# Altium schematic sheet MCU.SchDoc: N64 Controller
size A4; Author: TheComet; Revision: 1.0.0; ProjectName: N64 Controller
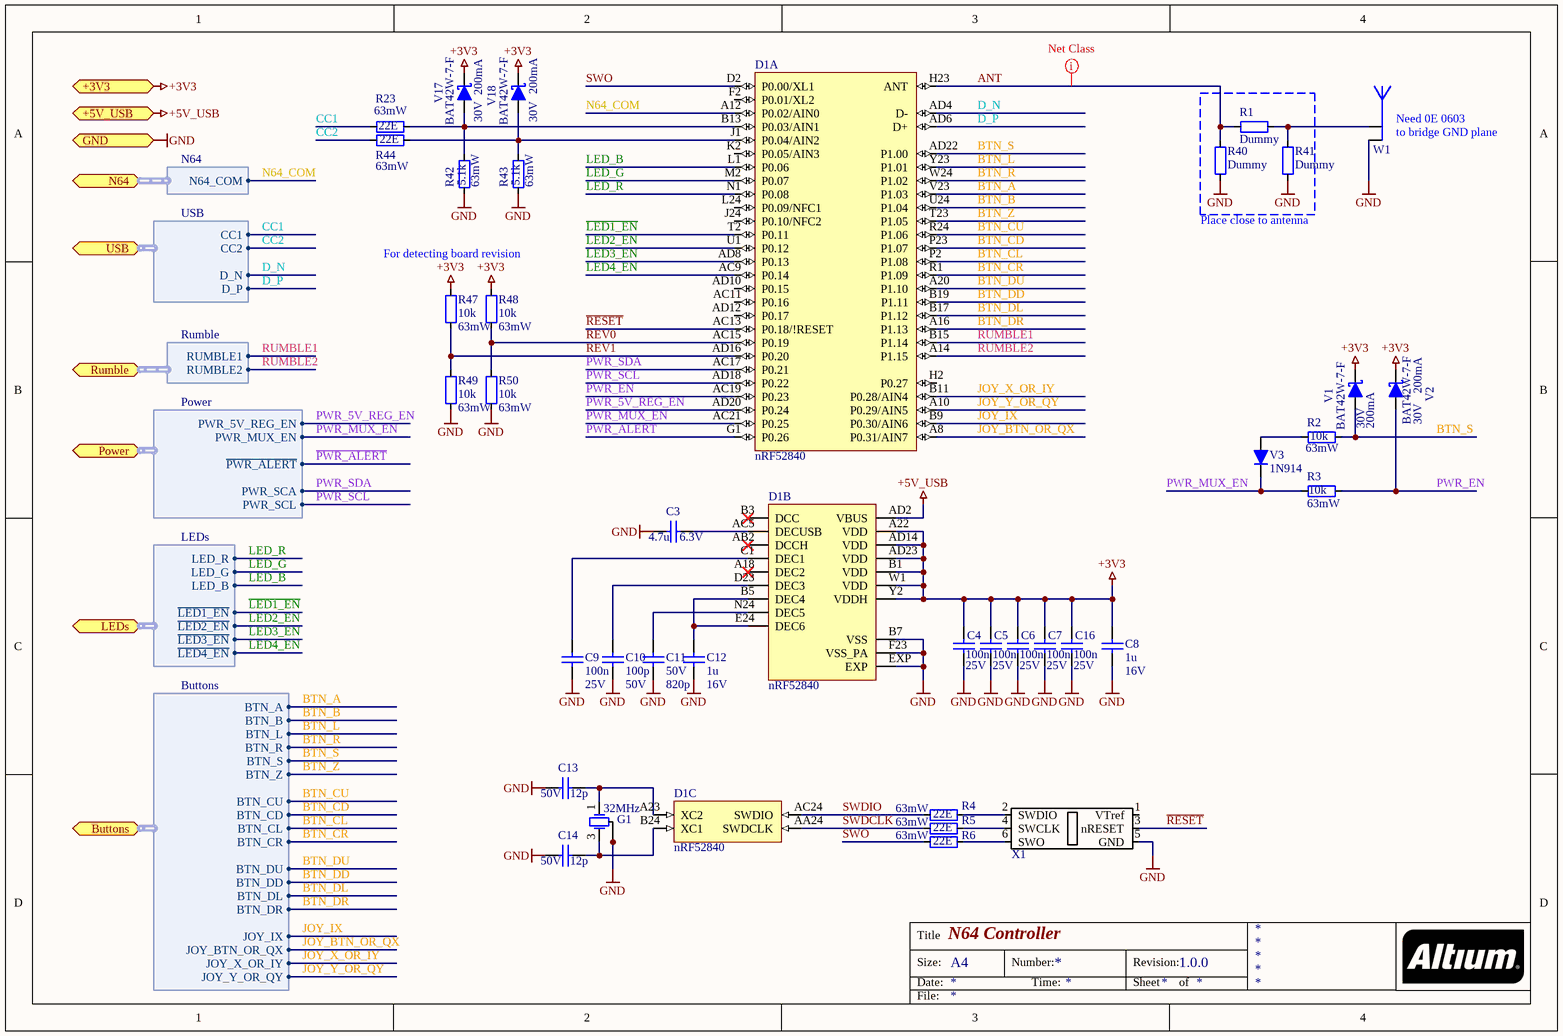
[diagram p0: MCU.SchDoc]

## Parts
C3  value 4.7u  Value2: 6.3V  [SMD_CAP_0603]  (hidden comment: C_SMD_CER_4U7_6V3_10%_X5R_0603)
C4  value 100n  Value2: 25V  [SMD_CAP_0402]  (hidden comment: C_SMD_CER_100N_25V_10%_X7R_0402)
C5  value 100n  Value2: 25V  [SMD_CAP_0402]  (hidden comment: C_SMD_CER_100N_25V_10%_X7R_0402)
C6  value 100n  Value2: 25V  [SMD_CAP_0402]  (hidden comment: C_SMD_CER_100N_25V_10%_X7R_0402)
C7  value 100n  Value2: 25V  [SMD_CAP_0402]  (hidden comment: C_SMD_CER_100N_25V_10%_X7R_0402)
C8  value 1u  Value2: 16V  [SMD_CAP_0603]  (hidden comment: C_SMD_CER_1U_16V_10%_X7R_0603)
C9  value 100n  Value2: 25V  [SMD_CAP_0402]  (hidden comment: C_SMD_CER_100N_25V_10%_X7R_0402)
C10  value 100p  Value2: 50V  [SMD_CAP_0402]  (hidden comment: C_SMD_CER_100P_50V_5%_NP0_0402)
C11  value 820p  Value2: 50V  [SMD_CAP_0402]  (hidden comment: C_SMD_CER_820P_50V_5%_NP0_0402)
C12  value 1u  Value2: 16V  [SMD_CAP_0603]  (hidden comment: C_SMD_CER_1U_16V_10%_X7R_0603)
C13  value 12p  Value2: 50V  [SMD_CAP_0402]  (hidden comment: C_SMD_CER_12P_50V_2%_NP0_0402)
C14  value 12p  Value2: 50V  [SMD_CAP_0402]  (hidden comment: C_SMD_CER_12P_50V_2%_NP0_0402)
C16  value 100n  Value2: 25V  [SMD_CAP_0402]  (hidden comment: C_SMD_CER_100N_25V_10%_X7R_0402)
D1  Type: nRF52840  [SMD_aQFN_73_nRF52840]  (hidden comment: D_NRF52840_aQFN-73)  (parts A,B,C of 3)
G1  value 32MHz  [SMD_QUARZ_3.2X2.5]  (hidden comment: G_SMD_OSC_XTAL_32MHZ_10PPM_8PF_40OHM)
R1  Dummy  [SMD_RES_0402]
R2  value 10k  Value2: 63mW  [SMD_RES_0402]  (hidden comment: R_SMD_THINFILM_10K_0W063_0%5_25PPM_0402)
R3  value 10k  Value2: 63mW  [SMD_RES_0402]  (hidden comment: R_SMD_THINFILM_10K_0W063_0%5_25PPM_0402)
R4  value 22E  Value2: 63mW  [SMD_RES_0402]  (hidden comment: R_SMD_THICKFILM_22E_0W063_1%_100PPM_0402)
R5  value 22E  Value2: 63mW  [SMD_RES_0402]  (hidden comment: R_SMD_THICKFILM_22E_0W063_1%_100PPM_0402)
R6  value 22E  Value2: 63mW  [SMD_RES_0402]  (hidden comment: R_SMD_THICKFILM_22E_0W063_1%_100PPM_0402)
R23  value 22E  Value2: 63mW  [SMD_RES_0402]  (hidden comment: R_SMD_THICKFILM_22E_0W063_1%_100PPM_0402)
R40  Dummy  [SMD_RES_0402]
R41  Dummy  [SMD_RES_0402]
R42  value 5.1k  Value2: 63mW  [SMD_CAP_0402]  (hidden comment: R_SMD_THINFILM_5K1_0W063_0%5_25PPM_0402)
R43  value 5.1k  Value2: 63mW  [SMD_CAP_0402]  (hidden comment: R_SMD_THINFILM_5K1_0W063_0%5_25PPM_0402)
R44  value 22E  Value2: 63mW  [SMD_RES_0402]  (hidden comment: R_SMD_THICKFILM_22E_0W063_1%_100PPM_0402)
R47  value 10k  Value2: 63mW  [SMD_RES_0402]  (hidden comment: R_SMD_THINFILM_10K_0W063_0%5_25PPM_0402)
R48  value 10k  Value2: 63mW  [SMD_RES_0402]  (hidden comment: R_SMD_THINFILM_10K_0W063_0%5_25PPM_0402)
R49  value 10k  Value2: 63mW  [SMD_RES_0402]  (hidden comment: R_SMD_THINFILM_10K_0W063_0%5_25PPM_0402)
R50  value 10k  Value2: 63mW  [SMD_RES_0402]  (hidden comment: R_SMD_THINFILM_10K_0W063_0%5_25PPM_0402)
V1  value 30V  Type: BAT42W-7-F  Value2: 200mA  [SMD_SOD_123]  (hidden comment: V_SMD_SCHOTTKY_BAT42W-7-F_30V_0A2_SOD-123)
V2  value 30V  Type: BAT42W-7-F  Value2: 200mA  [SMD_SOD_123]  (hidden comment: V_SMD_SCHOTTKY_BAT42W-7-F_30V_0A2_SOD-123)
V3  Type: 1N914  [SMD_SOD_323]  (hidden comment: V_SMD_DIODE_1N914_75V_0A15_SOD-323)
V17  value 30V  Type: BAT42W-7-F  Value2: 200mA  [SMD_SOD_123]  (hidden comment: V_SMD_SCHOTTKY_BAT42W-7-F_30V_0A2_SOD-123)
V18  value 30V  Type: BAT42W-7-F  Value2: 200mA  [SMD_SOD_123]  (hidden comment: V_SMD_SCHOTTKY_BAT42W-7-F_30V_0A2_SOD-123)
W1  W_BLUETOOTH_IFA_1MM  [BLUETOOTH_IFA_1MM]  (value not drawn)
X1  X_J-LINK_6-PIN_NEEDLE_HEADER  [SMD_J-LINK_6-PIN_NEEDLE]  (value not drawn)

## Ports
+3V3, +5V_USB, Buttons (harness Buttons), GND, LEDs (harness LEDs), N64 (harness N64), Power (harness Power), Rumble (harness Rumble), USB (harness USB)

## Harnesses
LEDs: LED_R, LED_G, LED_B, ~{LED1_EN}, ~{LED2_EN}, ~{LED3_EN}, ~{LED4_EN}
Rumble: RUMBLE1, RUMBLE2
N64: N64_COM
Buttons: BTN_A, BTN_B, BTN_CD, BTN_CL, BTN_CR, BTN_CU, BTN_DD, BTN_DL, BTN_DR, BTN_DU, BTN_L, BTN_R, BTN_S, BTN_Z, JOY_BTN_OR_QX, JOY_IX, JOY_X_OR_IY, JOY_Y_OR_QY
Power: ~{PWR_ALERT}, PWR_5V_REG_EN, PWR_MUX_EN, PWR_SCA, PWR_SCL
USB: CC1, CC2, D_N, D_P

## Nets
+3V3: C4.2 C5.2 C6.2 C7.2 C8.2 C16.2 D1.A22(VDD) D1.AD14(VDD) D1.AD23(VDD) D1.B1(VDD) D1.W1(VDD) D1.Y2(VDDH) R47.1 R48.1 V1.2 V2.2 V17.2 V18.2 ; port +3V3
+5V_USB: D1.AD2(VBUS) ; port +5V_USB
GND: C3.1 C4.1 C5.1 C6.1 C7.1 C8.1 C9.2 C10.1 C11.1 C12.1 C13.1 C14.1 C16.1 D1.B7(VSS) D1.EXP D1.F23(VSS_PA) G1.2 G1.4 R40.1 R41.1 R42.1 R43.1 R49.2 R50.2 W1.1(GND) X1.5(GND) ; port GND
ANT: D1.H23(ANT) R1.1 R40.2
BTN_A: D1.V23(P1.03) ; port Buttons.BTN_A
BTN_B: D1.U24(P1.04) ; port Buttons.BTN_B
BTN_CD: D1.P23(P1.07) ; port Buttons.BTN_CD
BTN_CL: D1.P2(P1.08) ; port Buttons.BTN_CL
BTN_CR: D1.R1(P1.09) ; port Buttons.BTN_CR
BTN_CU: D1.R24(P1.06) ; port Buttons.BTN_CU
BTN_DD: D1.B19(P1.11) ; port Buttons.BTN_DD
BTN_DL: D1.B17(P1.12) ; port Buttons.BTN_DL
BTN_DR: D1.A16(P1.13) ; port Buttons.BTN_DR
BTN_DU: D1.A20(P1.10) ; port Buttons.BTN_DU
BTN_L: D1.Y23(P1.01) ; port Buttons.BTN_L
BTN_R: D1.W24(P1.02) ; port Buttons.BTN_R
BTN_S: D1.AD22(P1.00) R2.2 V1.1 ; port Buttons.BTN_S
BTN_Z: D1.T23(P1.05) ; port Buttons.BTN_Z
CC1: R23.1 ; port USB.CC1
CC2: R44.1 ; port USB.CC2
D_N: D1.AD4(D-) ; port USB.D_N
D_P: D1.AD6(D+) ; port USB.D_P
JOY_BTN_OR_QX: D1.A8(P0.31/AIN7) ; port Buttons.JOY_BTN_OR_QX
JOY_IX: D1.B9(P0.30/AIN6) ; port Buttons.JOY_IX
JOY_X_OR_IY: D1.B11(P0.28/AIN4) ; port Buttons.JOY_X_OR_IY
JOY_Y_OR_QY: D1.A10(P0.29/AIN5) ; port Buttons.JOY_Y_OR_QY
~{LED1_EN}: D1.T2(P0.11) ; port LEDs.~{LED1_EN}
~{LED2_EN}: D1.U1(P0.12) ; port LEDs.~{LED2_EN}
~{LED3_EN}: D1.AD8(P0.13) ; port LEDs.~{LED3_EN}
~{LED4_EN}: D1.AC9(P0.14) ; port LEDs.~{LED4_EN}
LED_B: D1.L1(P0.06) ; port LEDs.LED_B
LED_G: D1.M2(P0.07) ; port LEDs.LED_G
LED_R: D1.N1(P0.08) ; port LEDs.LED_R
N64_COM: D1.A12(P0.02/AIN0) ; port N64.N64_COM
~{PWR_ALERT}: D1.G1(P0.26) ; port Power.~{PWR_ALERT}
PWR_5V_REG_EN: D1.AD20(P0.24) ; port Power.PWR_5V_REG_EN
PWR_EN: D1.AC19(P0.23) R3.2 V2.1
PWR_MUX_EN: D1.AC21(P0.25) R3.1 V3.2 ; port Power.PWR_MUX_EN
PWR_SCL: D1.AD18(P0.22) ; port Power.PWR_SCL
PWR_SDA: D1.AC17(P0.21) ; port Power.PWR_SCA
~{RESET}: D1.AC13(P0.18/!RESET) X1.3(nRESET)
REV0: D1.AC15(P0.19) R48.2 R50.1
REV1: D1.AD16(P0.20) R47.2 R49.1
RUMBLE1: D1.B15(P1.14) ; port Rumble.RUMBLE1
RUMBLE2: D1.A14(P1.15) ; port Rumble.RUMBLE2
SWDCLK: D1.AA24(SWDCLK) R5.1
SWDIO: D1.AC24(SWDIO) R4.1
SWO: D1.D2(P0.00/XL1) R6.1
NetC3_2: C3.2 D1.AC5(DECUSB)
NetC9_1: C9.1 D1.C1(DEC1)
NetC10_2: C10.2 D1.D23(DEC3)
NetC11_2: C11.2 D1.N24(DEC5)
NetC12_2: C12.2 D1.B5(DEC4) D1.E24(DEC6)
NetC13_2: C13.2 D1.A23(XC2) G1.1(OSC1)
NetC14_2: C14.2 D1.B24(XC1) G1.3(OSC2)
NetD1_B13: D1.B13(P0.03/AIN1) R23.2 R42.2 V17.1
NetD1_J1: D1.J1(P0.04/AIN2) R43.2 R44.2 V18.1
NetR1_2: R1.2 R41.2 W1.2(Feed)
NetR2_1: R2.1 V3.1
NetR4_2: R4.2 X1.2(SWDIO)
NetR5_2: R5.2 X1.4(SWCLK)
NetR6_2: R6.2 X1.6(SWO)

Not connected (* = marked no-connect by the designer): D1 A18(DEC2)* AB2(DCCH)* AC11(P0.16) AD10(P0.15) AD12(P0.17) B3(DCC)* F2(P0.01/XL2) H2(P0.27) J24(P0.10/NFC2) K2(P0.05/AIN3) L24(P0.09/NFC1); X1 1(VTref)

## Layout directives
net class SINGLE50: ANT

## Notes on the sheet
- (near W1) Need 0E 0603
- (near W1) to bridge GND plane
- Place close to antenna
- For detecting board revision
- Title
- Size:
- Date:
- A4
- Number:
- Time:
- Revision:
- Sheet
- of
- File:

## Library data of the parts
C4-C7 C9 C16 = C_SMD_CER_100N_25V_10%_X7R_0402: 0.1µF ±10% 25V Ceramic Capacitor X7R 0402 (1005 Metric); Supplier - Digikey: 490-14603-1-ND
C8 C12 = C_SMD_CER_1U_16V_10%_X7R_0603: 1µF ±10% 16V Ceramic Capacitor X7R 0603 (1608 Metric); Supplier - Digikey: 1276-1019-1-ND
C11 = C_SMD_CER_820P_50V_5%_NP0_0402: 820pF ±5% 50V Ceramic Capacitor C0G, NP0 0402 (1005 Metric); Supplier - Digikey: 490-11407-1-ND
C13 C14 = C_SMD_CER_12P_50V_2%_NP0_0402: 12pF ±2% 50V Ceramic Capacitor C0G, NP0 0402 (1005 Metric); Supplier - Digikey: 490-6197-1-ND
D1 = D_NRF52840_aQFN-73: IC RF TxRx + MCU 802.15.4, Bluetooth Bluetooth v5.0 2.4GHz 73-VFQFN Dual Rows, Exposed Pad; Supplier - Digikey: 1490-1071-1-ND
G1 = G_SMD_OSC_XTAL_32MHZ_10PPM_8PF_40OHM: 32MHz ±10ppm Crystal 8pF 40 Ohms 4-SMD, No Lead; Supplier - Digikey: 1908-1300-1-ND
R1 R40 R41 = R_SMD_DUMMY_0402: Dummy 0402; Value: Dummy
R2 R3 R47-R50 = R_SMD_THINFILM_10K_0W063_0%5_25PPM_0402: SMD Resistor; Supplier - Digikey: P10KDECT-ND
R4-R6 R23 R44 = R_SMD_THICKFILM_22E_0W063_1%_100PPM_0402: 22 Ohms ±1% 0.063W, 1/16W Chip Resistor 0402 (1005 Metric) Moisture Resistant Thick Film; Supplier - Digikey: 311-22.0LRCT-ND
R42 R43 = R_SMD_THINFILM_5K1_0W063_0%5_25PPM_0402: 5.1 kOhms ±0.5% 0.063W, 1/16W Chip Resistor 0402 (1005 Metric) Automotive AEC-Q200 Thin Film; Supplier - Digikey: RNCF0402DTE5K10CT-ND
V1 V2 V17 V18 = V_SMD_SCHOTTKY_BAT42W-7-F_30V_0A2_SOD-123: Diode Schottky 30V 200mA (DC) Surface Mount SOD-123; Supplier - Digikey: BAT42W-FDICT-ND
V3 = V_SMD_DIODE_1N914_75V_0A15_SOD-323: SMD Diode, 75V, 0.15A; Supplier - Digikey: 1N914BWSCT-ND
W1 = W_BLUETOOTH_IFA_1MM: Single Layer Printed IFA, 1 mm Substrate
X1 = X_J-LINK_6-PIN_NEEDLE_HEADER: J-Link 6-pin Needle Adapter (8.06.16); Supplier - Segger: 8.06.16
C3 = C_SMD_CER_4U7_6V3_10%_X5R_0603: Supplier - Digikey: 1276-1045-1-ND
C10 = C_SMD_CER_100P_50V_5%_NP0_0402: Supplier - Digikey: 311-1024-1-ND